# Altium project helix_4_multi_shield_host.PrjPcb
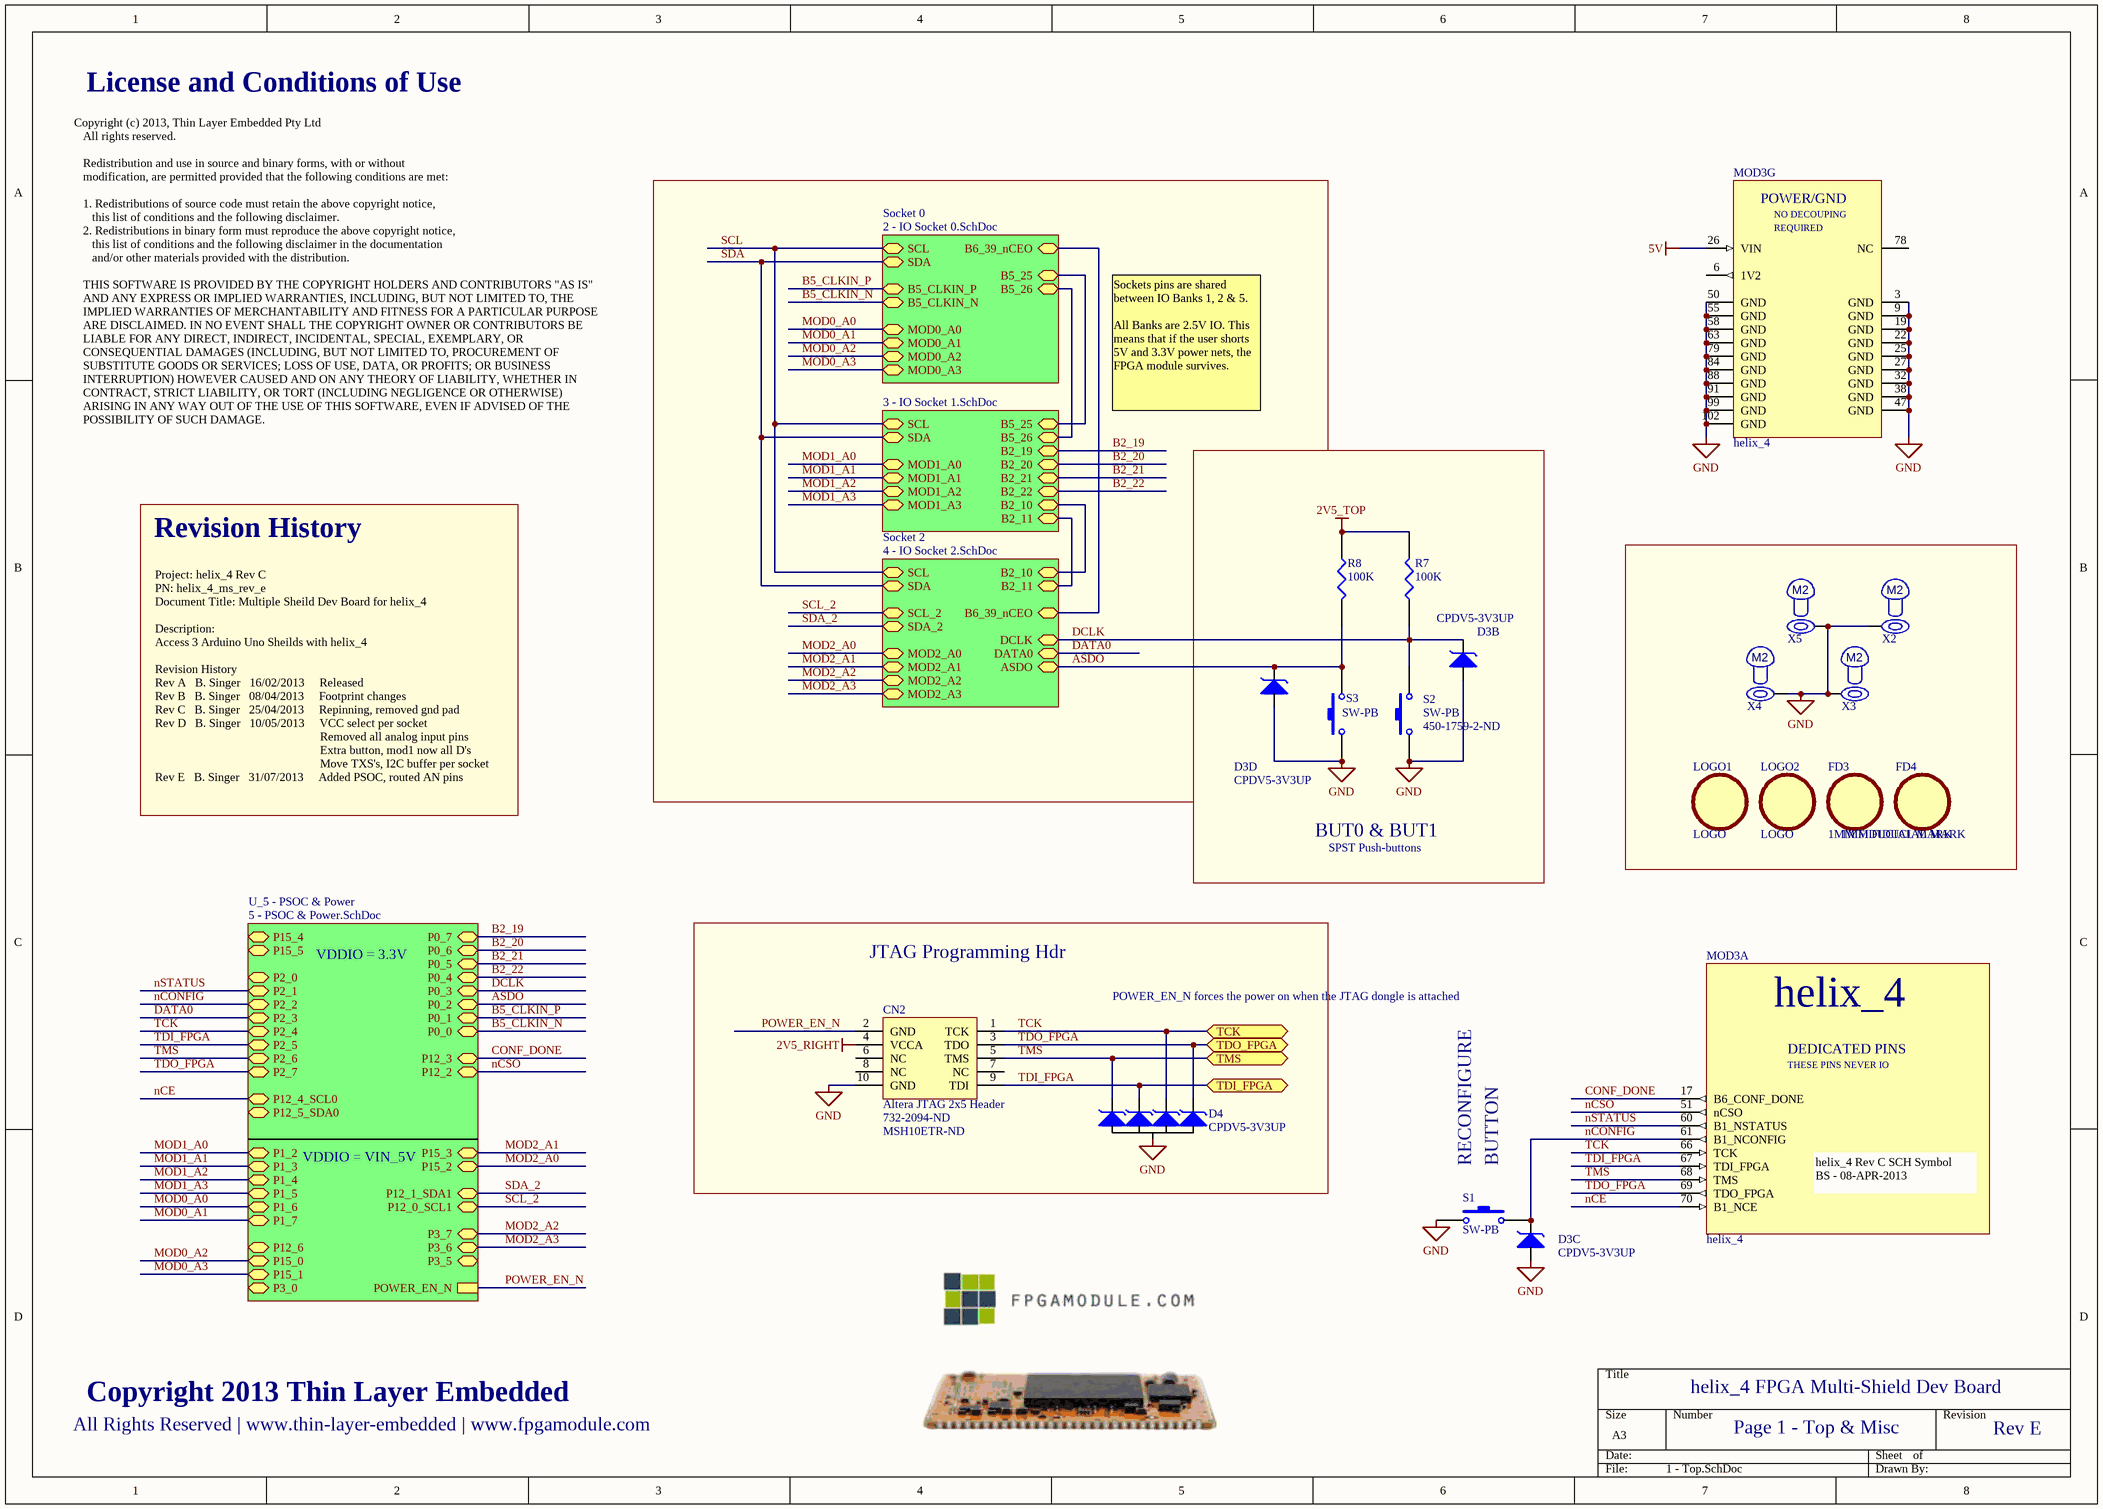
[diagram p0: 1 - Top.SchDoc]
5 sheets, 121 parts. Net scope: hierarchical (ports join the sheet entries above them; power ports are global).
Board file: helix_4_multi_shield_host.PcbDoc
Sheets:
  1 - Top.SchDoc
    Socket 1 = 3 - IO Socket 1.SchDoc
    Socket 0 = 2 - IO Socket 0.SchDoc
    Socket 2 = 4 - IO Socket 2.SchDoc
    U_5 - PSOC & Power = 5 - PSOC & Power.SchDoc

## Sheet 1 - Top.SchDoc
size A3; PageSetup: Record=PageOptions|CenterHorizontal=True|CenterVertical=True|PrintScale=0.71|XCorrection=1.00|YCorrection=1.00|PrintKind=0|BorderSize=5000000|LeftOffset=0|BottomOffset=0|Orientation=2|PaperLength=2970|PaperWidth=2100|Scale=100|PaperSource=7|PrintQuality=-4|MediaType=1|DitherType=10|PaperKind=A4 (210 x 297 mm)|PrintScaleMode=1

### Parts
CN2  Altera JTAG 2x5 Header  Supplier Part Number 1: 732-2094-ND  Supplier Part Number 2: MSH10ETR-ND  [BOXHDR2X5]
D3  CPDV5-3V3UP  [sot-353]  (parts B,C,D of 4)
D4  CPDV5-3V3UP  [SOT-353]
FD3  1MM FIDUCIAL MARK  [FID_1MM]
FD4  1MM FIDUCIAL MARK  [FID_1MM]
LOGO1  LOGO  [LOGO_LARGE]
LOGO2  LOGO  [LOGO_LARGE]
MOD3  helix_4  [HELIX_4_LCC104_HOST]  (parts A,G of 7)
R7  100K  [0805]
R8  100K  [0805]
S1  SW-PB  [FSM4JSMA]
S2  SW-PB  [FSM4JSMA]
S3  SW-PB  Supplier Part Number 1: 450-1759-2-ND  [FSM4JSMA]
X2  M2 Mounting Hole  [Mounting_Hole_M3]  (value not drawn)
X3  M2 Mounting Hole  [Mounting_Hole_M3]  (value not drawn)
X4  M2 Mounting Hole  [Mounting_Hole_M3]  (value not drawn)
X5  M2 Mounting Hole  [Mounting_Hole_M3]  (value not drawn)

### Blocks framed on the sheet
BUT0 & BUT1: D3 R7 R8 S2 S3
JTAG Programming Hdr: CN2 D4

### Sub-sheets
Socket 0 = 2 - IO Socket 0.SchDoc: SCL, SDA, B5_25, B5_26, B6_39_nCEO, B5_CLKIN_P, B5_CLKIN_N, MOD0_A0, MOD0_A1, MOD0_A2, MOD0_A3
Socket 1 = 3 - IO Socket 1.SchDoc: SDA, SCL, B5_26, B5_25, MOD1_A0, MOD1_A1, MOD1_A2, MOD1_A3, B2_10, B2_11, B2_19, B2_20, B2_21, B2_22
Socket 2 = 4 - IO Socket 2.SchDoc: SDA, SCL, DCLK, DATA0, B6_39_nCEO, ASDO, MOD2_A0, MOD2_A1, MOD2_A2, MOD2_A3, SDA_2, SCL_2, B2_10, B2_11
U_5 - PSOC & Power = 5 - PSOC & Power.SchDoc: P15_4, P15_5, P12_6, P2_0, P1_5, P1_6, P1_7, P2_1, P2_2, P2_3, P2_4, P2_5, P2_6, P2_7, P12_3, P12_2, POWER_EN_N, P0_0, P1_4, P1_3, P12_4_SCL0, P12_5_SDA0, P12_1_SDA1, P12_0_SCL1, P1_2, P0_1, P0_2, P0_3, P0_4, P0_5, P0_6, P0_7, P3_5, P3_6, P3_7, P15_0, P15_2, P15_3, P15_1, P3_0

### Ports
TCK, TDI_FPGA, TDO_FPGA, TMS

### Nets
2V5_RIGHT: CN2.4(VCCA)
2V5_TOP: R7.1 R8.1
5V: MOD3.26(VIN)
GND: CN2.10(GND) D3.2(A) D4.2(A) MOD3.3(GND) MOD3.9(GND) MOD3.19(GND) MOD3.22(GND) MOD3.25(GND) MOD3.27(GND) MOD3.32(GND) MOD3.38(GND) MOD3.47(GND) MOD3.50(GND) MOD3.55(GND) MOD3.58(GND) MOD3.63(GND) MOD3.79(GND) MOD3.84(GND) MOD3.88(GND) MOD3.91(GND) MOD3.99(GND) MOD3.102(GND) S1.1 S2.1 S3.1 X2.1 X3.1 X4.1 X5.1
ASDO: D3.4(K4) R8.2 S3.2 ; sheet Socket 2/ASDO, sheet U_5 - PSOC & Power/P0_2
B1_10: sheet Socket 1/B2_10, sheet Socket 2/B2_10
B1_11: sheet Socket 1/B2_11, sheet Socket 2/B2_11
B2_19: sheet Socket 1/B2_19, sheet U_5 - PSOC & Power/P0_7
B2_20: sheet Socket 1/B2_20, sheet U_5 - PSOC & Power/P0_6
B2_21: sheet Socket 1/B2_21, sheet U_5 - PSOC & Power/P0_5
B2_22: sheet Socket 1/B2_22, sheet U_5 - PSOC & Power/P0_4
B5_25: sheet Socket 1/B5_25, sheet Socket 0/B5_25
B5_26: sheet Socket 1/B5_26, sheet Socket 0/B5_26
B5_CLKIN_N: sheet Socket 0/B5_CLKIN_N, sheet U_5 - PSOC & Power/P0_0
B5_CLKIN_P: sheet Socket 0/B5_CLKIN_P, sheet U_5 - PSOC & Power/P0_1
B6_39_nCEO: sheet Socket 0/B6_39_nCEO, sheet Socket 2/B6_39_nCEO
CONF_DONE: MOD3.17(B6_CONF_DONE) ; sheet U_5 - PSOC & Power/P12_3
DATA0: sheet Socket 2/DATA0, sheet U_5 - PSOC & Power/P2_3
DCLK: D3.1(K2) R7.2 S2.2 ; sheet Socket 2/DCLK, sheet U_5 - PSOC & Power/P0_3
MOD0_A0: sheet Socket 0/MOD0_A0, sheet U_5 - PSOC & Power/P1_6
MOD0_A1: sheet Socket 0/MOD0_A1, sheet U_5 - PSOC & Power/P1_7
MOD0_A2: sheet Socket 0/MOD0_A2, sheet U_5 - PSOC & Power/P15_0
MOD0_A3: sheet Socket 0/MOD0_A3, sheet U_5 - PSOC & Power/P15_1
MOD1_A0: sheet Socket 1/MOD1_A0, sheet U_5 - PSOC & Power/P1_2
MOD1_A1: sheet Socket 1/MOD1_A1, sheet U_5 - PSOC & Power/P1_3
MOD1_A2: sheet Socket 1/MOD1_A2, sheet U_5 - PSOC & Power/P1_4
MOD1_A3: sheet Socket 1/MOD1_A3, sheet U_5 - PSOC & Power/P1_5
MOD2_A0: sheet Socket 2/MOD2_A0, sheet U_5 - PSOC & Power/P15_2
MOD2_A1: sheet Socket 2/MOD2_A1, sheet U_5 - PSOC & Power/P15_3
MOD2_A2: sheet Socket 2/MOD2_A2, sheet U_5 - PSOC & Power/P3_7
MOD2_A3: sheet Socket 2/MOD2_A3, sheet U_5 - PSOC & Power/P3_6
nCE: MOD3.70(B1_NCE) ; sheet U_5 - PSOC & Power/P12_4_SCL0
nCONFIG: D3.5(K3) MOD3.61(B1_NCONFIG) S1.2 ; sheet U_5 - PSOC & Power/P2_2
nCSO: MOD3.51(nCSO) ; sheet U_5 - PSOC & Power/P12_2
nSTATUS: MOD3.60(B1_NSTATUS) ; sheet U_5 - PSOC & Power/P2_1
POWER_EN_N: CN2.2(GND) ; sheet U_5 - PSOC & Power/POWER_EN_N
SCL: sheet Socket 1/SCL, sheet Socket 0/SCL, sheet Socket 2/SCL
SCL_2: sheet Socket 2/SCL_2, sheet U_5 - PSOC & Power/P12_0_SCL1
SDA: sheet Socket 1/SDA, sheet Socket 0/SDA, sheet Socket 2/SDA
SDA_2: sheet Socket 2/SDA_2, sheet U_5 - PSOC & Power/P12_1_SDA1
TCK: CN2.1(TCK) D4.5(K1) MOD3.66(TCK) ; port TCK, sheet U_5 - PSOC & Power/P2_4
TDI_FPGA: CN2.9(TDI) D4.1(K2) MOD3.67(TDI_FPGA) ; port TDI_FPGA, sheet U_5 - PSOC & Power/P2_5
TDO_FPGA: CN2.3(TDO) D4.4(K2) MOD3.69(TDO_FPGA) ; port TDO_FPGA, sheet U_5 - PSOC & Power/P2_7
TMS: CN2.5(TMS) D4.3(K1) MOD3.68(TMS) ; port TMS, sheet U_5 - PSOC & Power/P2_6

Not connected (* = marked no-connect by the designer): CN2 6(NC) 7(NC) 8(NC); FD3 1(FID); FD4 1(FID); LOGO1 1(FID); LOGO2 1(FID); MOD3 6(1V2) 78(NC)

### Notes on the sheet
- License and Conditions of Use
- Sockets pins are shared between IO Banks 1, 2 & 5.
  All Banks are 2.5V IO. This means that if the user shorts 5V and 3.3V power nets, the FPGA module survives.
- Copyright (c) 2013, Thin Layer Embedded Pty Ltd
  All rights reserved.
  Redistribution and use in source and binary forms, with or without
  modification, are permitted provided that the following conditions are met:
  1. Redistributions of source code must retain the above copyright notice,
  this list of conditions and the following disclaimer.
  2. Redistributions in binary form must reproduce the above copyright notice,
  this list of conditions and the following disclaimer in the documentation
  and/or other materials provided with the distribution.
  THIS SOFTWARE IS PROVIDED BY THE COPYRIGHT HOLDERS AND CONTRIBUTORS "AS IS"
  AND ANY EXPRESS OR IMPLIED WARRANTIES, INCLUDING, BUT NOT LIMITED TO, THE
  IMPLIED WARRANTIES OF MERCHANTABILITY AND FITNESS FOR A PARTICULAR PURPOSE
  ARE DISCLAIMED. IN NO EVENT SHALL THE COPYRIGHT OWNER OR CONTRIBUTORS BE
  LIABLE FOR ANY DIRECT, INDIRECT, INCIDENTAL, SPECIAL, EXEMPLARY, OR
  CONSEQUENTIAL DAMAGES (INCLUDING, BUT NOT LIMITED TO, PROCUREMENT OF
  SUBSTITUTE GOODS OR SERVICES; LOSS OF USE, DATA, OR PROFITS; OR BUSINESS
  INTERRUPTION) HOWEVER CAUSED AND ON ANY THEORY OF LIABILITY, WHETHER IN
  CONTRACT, STRICT LIABILITY, OR TORT (INCLUDING NEGLIGENCE OR OTHERWISE)
  ARISING IN ANY WAY OUT OF THE USE OF THIS SOFTWARE, EVEN IF ADVISED OF THE
  POSSIBILITY OF SUCH DAMAGE.
- Revision History
- Project: helix_4 Rev C
  PN: helix_4_ms_rev_e
  Document Title: Multiple Sheild Dev Board for helix_4
  Description:
  Access 3 Arduino Uno Sheilds with helix_4
  Revision History
  Rev A   B. Singer   16/02/2013     Released
  Rev B   B. Singer   08/04/2013     Footprint changes
  Rev C   B. Singer   25/04/2013     Repinning, removed gnd pad
  Rev D   B. Singer   10/05/2013     VCC select per socket
  Removed all analog input pins
  Extra button, mod1 now all D's
  Move TXS's, I2C buffer per socket
  Rev E   B. Singer   31/07/2013     Added PSOC, routed AN pins
- SPST Push-buttons
- VDDIO = 3.3V
- (near CN2) POWER_EN_N forces the power on when the JTAG dongle is attached
- VDDIO = VIN_5V
- RECONFIGURE
- BUTTON
- helix_4 FPGA Multi-Shield Dev Board
- All Rights Reserved | www.thin-layer-embedded | www.fpgamodule.com
- Copyright 2013 Thin Layer Embedded
- Page 1 - Top & Misc
- Rev E
- (in symbol helix_4 Rev C Module, part A) DEDICATED PINS; THESE PINS NEVER IO; helix_4 Rev C SCH Symbol / BS - 08-APR-2013 /
- (in symbol helix_4 Rev C Module, part G) POWER/GND; NO DECOUPING; REQUIRED
- (in symbol Mounting_Hole_M2) M2

### Library data of the parts
CN2 = Altera JTAG 2x5 Header: Header, 5-Pin, Dual row; Manufacturer: Wurth Electronics Inc; Manufacturer Part Number: 61201021621; Description: BOX HEADER 2.54MM MALE STR 10POS; Connector Type: Header, Shrouded; Number of Positions: 10; Number of Positions Loaded: All; Pitch: 0.100" (2.54mm); LatestRevisionDate: 17-Jul-2002; LatestRevisionNote: Re-released for DXP Platform.; Publisher: Altium Limited; Supplier 1: Digi-Key; RoHS: RoHS Compliant; Category: Connectors, Interconnects; Stock 1: 324; Pricing 1: 1=0.97, 25=0.8052, 100=0.713, 250=0.63252, 500=0.575, 1000=0.46, 2500=0.4025, 5000=0.3335, 10000=0.3059 (USD); Contact Type: Male Pin; Number of Rows: 2; Row Spacing: 0.100" (2.54mm); Contact Mating Length: -; Mounting Type: Through Hole; Termination: Solder; Fastening Type: -; Features: -; Contact Finish: Gold; Contact Finish Thickness: -; Color: Black; Packaging: Tray; ComponentLink1URL: http://www.we-online.de/eican/media/pdf/6120xx21621.pdf; ComponentLink1Description: http://www.we-online.de/eican/media/pdf/6120xx21621.pdf; Supplier 2: Digi-Key
D3 = 4CH ESD DIODE (SPLIT): 4CH ESD DIODE 3V3/3.5V
D4 = 4CH ESD DIODE: 4CH ESD DIODE 3V3/3.5V
FD3 FD4 LOGO1 LOGO2 = FID
MOD3 = helix_4 Rev C Module
R7 R8 = RES1
S1-S3 = SW-PB: Switch; Published: 24-Mar-1999; LatestRevisionDate: 17-Jul-2002; LatestRevisionNote: Re-released for DXP Platform.; PackageReference: SPST-2; Publisher: Altium Limited
  S3: Supplier 1: Digi-Key
X2-X5 = Mounting_Hole_M2: Hole for M3 Screw

## Sheet 3 - IO Socket 1.SchDoc
size A4
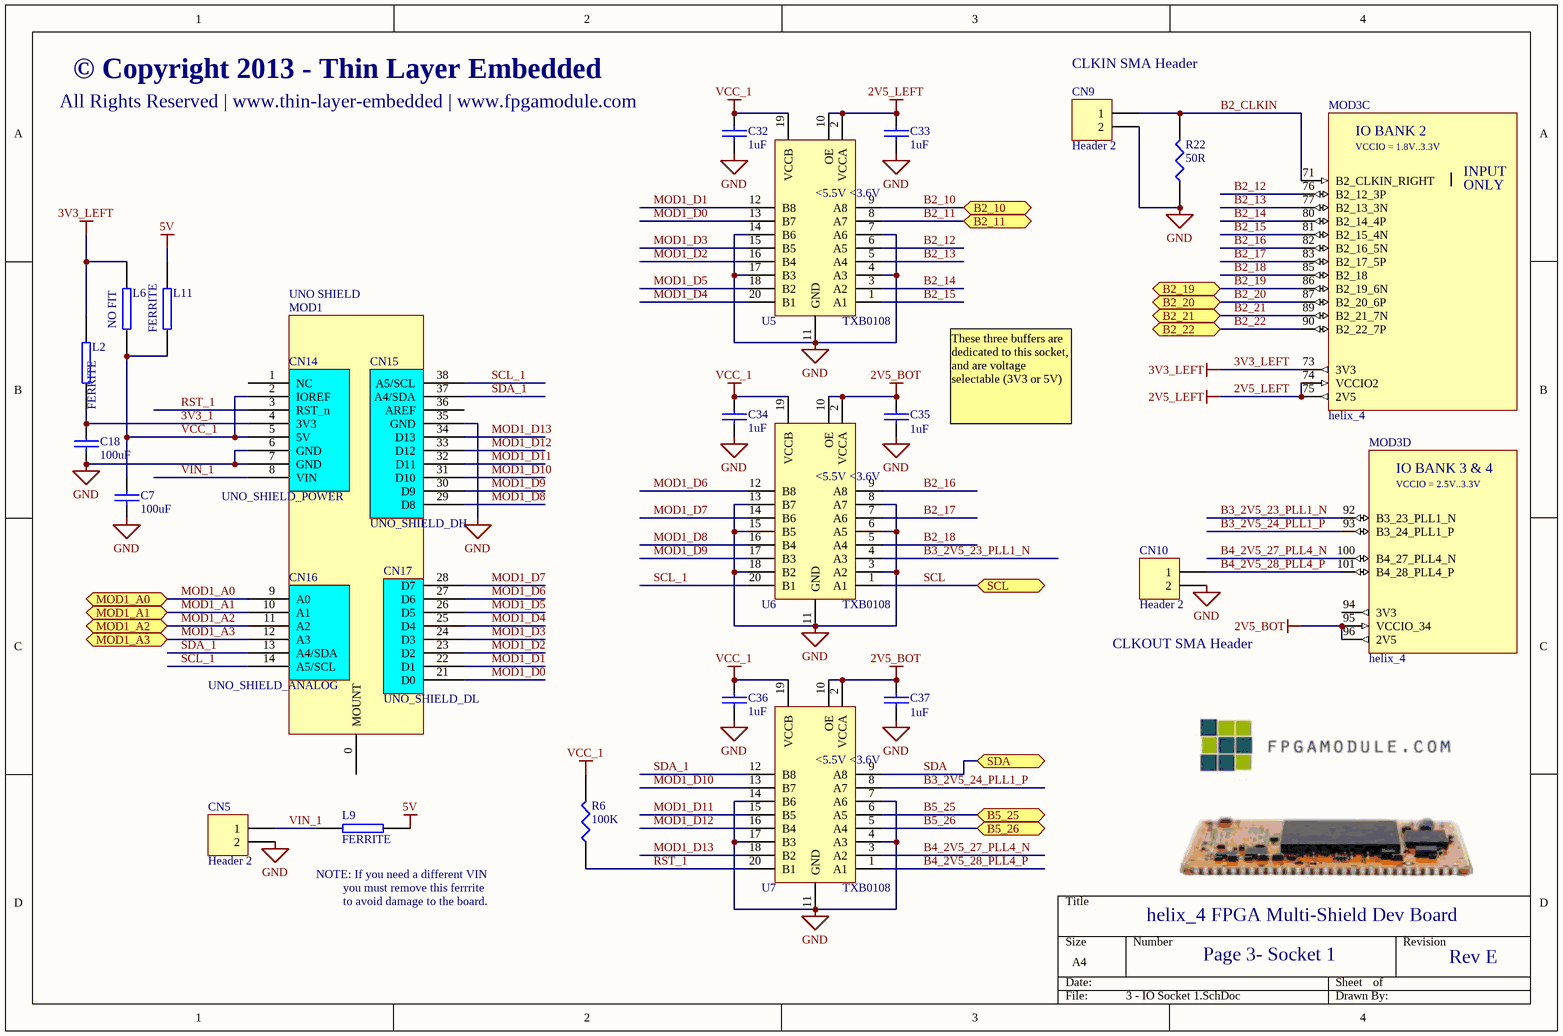
[diagram p1: 3 - IO Socket 1.SchDoc]

### Parts
C7  100uF  [1210]
C18  100uF  [1210]
C32  1uF  [0805]
C33  1uF  [0805]
C34  1uF  [0805]
C35  1uF  [0805]
C36  1uF  [0805]
C37  1uF  [0805]
CN5  Header 2  [HDR1X2]
CN9  Header 2  [SMA_V]
CN10  Header 2  [SMA_V]
CN14  UNO_SHIELD_POWER  [UNO_SHIELD_POWER]
CN15  UNO_SHIELD_DH  [UNO_SHIELD_DH]
CN16  UNO_SHIELD_ANALOG  [UNO_SHIELD_ANALOG]
CN17  UNO_SHIELD_DL  [UNO_SHIELD_DL]
L2  FERRITE  [0805]
L6  NO FIT  [0805]
L9  FERRITE  [0805]
L11  FERRITE  [0805]
MOD1  UNO SHIELD  [UNO_SHIELD_MECH]
MOD3  helix_4  [HELIX_4_LCC104_HOST]  (parts C,D of 7)
R6  100K  [0805]
R22  50R  [0805]
U5  TXB0108  [TSSOP20]
U6  TXB0108  [TSSOP20]
U7  TXB0108  [TSSOP20]

### Ports
B2_10, B2_11, B2_19, B2_20, B2_21, B2_22, B5_25, B5_26, MOD1_A0, MOD1_A1, MOD1_A2, MOD1_A3, SCL, SDA

### Nets
2V5_BOT: C35.2 C37.2 MOD3.95(VCCIO_34) MOD3.96(2V5) U6.2(VCCA) U6.10(OE) U7.2(VCCA) U7.10(OE)
2V5_LEFT: C33.2 MOD3.74(VCCIO2) MOD3.75(2V5) U5.2(VCCA) U5.10(OE)
3V3_LEFT: L2.1 L6.1 MOD3.73(3V3)
5V: L9.1 L11.1
GND: C7.2 C18.2 C32.1 C33.1 C34.1 C35.1 C36.1 C37.1 CN5.2 CN9.2 CN10.2 CN14.6(GND) CN14.7(GND) CN15.35(GND) R22.1 U5.4(A3) U5.7(A6) U5.11(GND) U5.14(B6) U5.17(B3) U6.3(A2) U6.6(A5) U6.8(A7) U6.11(GND) U6.13(B7) U6.15(B5) U6.18(B2) U7.4(A3) U7.7(A6) U7.11(GND) U7.14(B6) U7.17(B3)
VCC_1: C7.1 C32.2 C34.2 C36.2 CN14.2(IOREF) CN14.5(5V) L6.2 L11.2 R6.2 U5.19(VCCB) U6.19(VCCB) U7.19(VCCB)
3V3_1: C18.1 CN14.4(3V3) L2.2
B2_10: U5.9(A8) ; port B2_10  [project net B1_10]
B2_11: U5.8(A7) ; port B2_11  [project net B1_11]
B2_12: MOD3.76(B2_12_3P) U5.6(A5)
B2_13: MOD3.77(B2_13_3N) U5.5(A4)
B2_14: MOD3.80(B2_14_4P) U5.3(A2)
B2_15: MOD3.81(B2_15_4N) U5.1(A1)
B2_16: MOD3.82(B2_16_5N) U6.9(A8)
B2_17: MOD3.83(B2_17_5P) U6.7(A6)
B2_18: MOD3.85(B2_18) U6.5(A4)
B2_19: MOD3.86(B2_19_6N) ; port B2_19
B2_20: MOD3.87(B2_20_6P) ; port B2_20
B2_21: MOD3.89(B2_21_7N) ; port B2_21
B2_22: MOD3.90(B2_22_7P) ; port B2_22
B2_CLKIN: CN9.1 MOD3.71(B2_CLKIN_RIGHT) R22.2
B3_2V5_23_PLL1_N: MOD3.92(B3_23_PLL1_N) U6.4(A3)
B3_2V5_24_PLL1_P: MOD3.93(B3_24_PLL1_P) U7.8(A7)
B4_2V5_27_PLL4_N: MOD3.100(B4_27_PLL4_N) U7.3(A2)
B4_2V5_28_PLL4_P: CN10.1 MOD3.101(B4_28_PLL4_P) U7.1(A1)
B5_25: U7.6(A5) ; port B5_25
B5_26: U7.5(A4) ; port B5_26
MOD1_A0: CN16.9(A0) ; port MOD1_A0
MOD1_A1: CN16.10(A1) ; port MOD1_A1
MOD1_A2: CN16.11(A2) ; port MOD1_A2
MOD1_A3: CN16.12(A3) ; port MOD1_A3
MOD1_D0: CN17.21(D0) U5.13(B7)
MOD1_D1: CN17.22(D1) U5.12(B8)
MOD1_D2: CN17.23(D2) U5.16(B4)
MOD1_D3: CN17.24(D3) U5.15(B5)
MOD1_D4: CN17.25(D4) U5.20(B1)
MOD1_D5: CN17.26(D5) U5.18(B2)
MOD1_D6: CN17.27(D6) U6.12(B8)
MOD1_D7: CN17.28(D7) U6.14(B6)
MOD1_D8: CN15.29(D8) U6.16(B4)
MOD1_D9: CN15.30(D9) U6.17(B3)
MOD1_D10: CN15.31(D10) U7.13(B7)
MOD1_D11: CN15.32(D11) U7.15(B5)
MOD1_D12: CN15.33(D12) U7.16(B4)
MOD1_D13: CN15.34(D13) U7.18(B2)
RST_1: CN14.3(RST_n) R6.1 U7.20(B1)
SCL: U6.1(A1) ; port SCL
SCL_1: CN15.38(A5/SCL) CN16.14(A5/SCL) U6.20(B1)
SDA: U7.9(A8) ; port SDA
SDA_1: CN15.37(A4/SDA) CN16.13(A4/SDA) U7.12(B8)
VIN_1: CN5.1 CN14.8(VIN) L9.2

Not connected (* = marked no-connect by the designer): CN14 1(NC); CN15 36(AREF); MOD1 0(MOUNT); MOD3 94(3V3)

### Notes on the sheet
- (near C32) All Rights Reserved | www.thin-layer-embedded | www.fpgamodule.com
- © Copyright 2013 - Thin Layer Embedded
- (near CN9) CLKIN SMA Header
- These three buffers are dedicated to this socket, and are voltage selectable (3V3 or 5V)
- (near CN10) CLKOUT SMA Header
- (near L9) NOTE: If you need a different VIN
- you must remove this ferrrite
- to avoid damage to the board.
- helix_4 FPGA Multi-Shield Dev Board
- Page 3- Socket 1
- Rev E
- (in symbol helix_4 Rev C Module, part C) IO BANK 2; VCCIO = 1.8V..3.3V; INPUT; ONLY
- (in symbol helix_4 Rev C Module, part D) IO BANK 3 & 4; VCCIO = 2.5V..3.3V
- (in symbol TXB0108) <5.5V; <3.6V

### Library data of the parts
C7 C18 C32-C37 = CAP: Capacitor
CN5 CN9 CN10 = Header 2: Header, 2-Pin; LatestRevisionDate: 17-Jul-2002; LatestRevisionNote: Re-released for DXP Platform.; Publisher: Altium Limited
L6 = FERRITE
MOD1 = UNO_SHIELD_MECH
MOD3 = helix_4 Rev C Module
R6 R22 = RES1
U5-U7 = TXB0108: TI Bir-dir buffer

## Sheet 2 - IO Socket 0.SchDoc
size A4
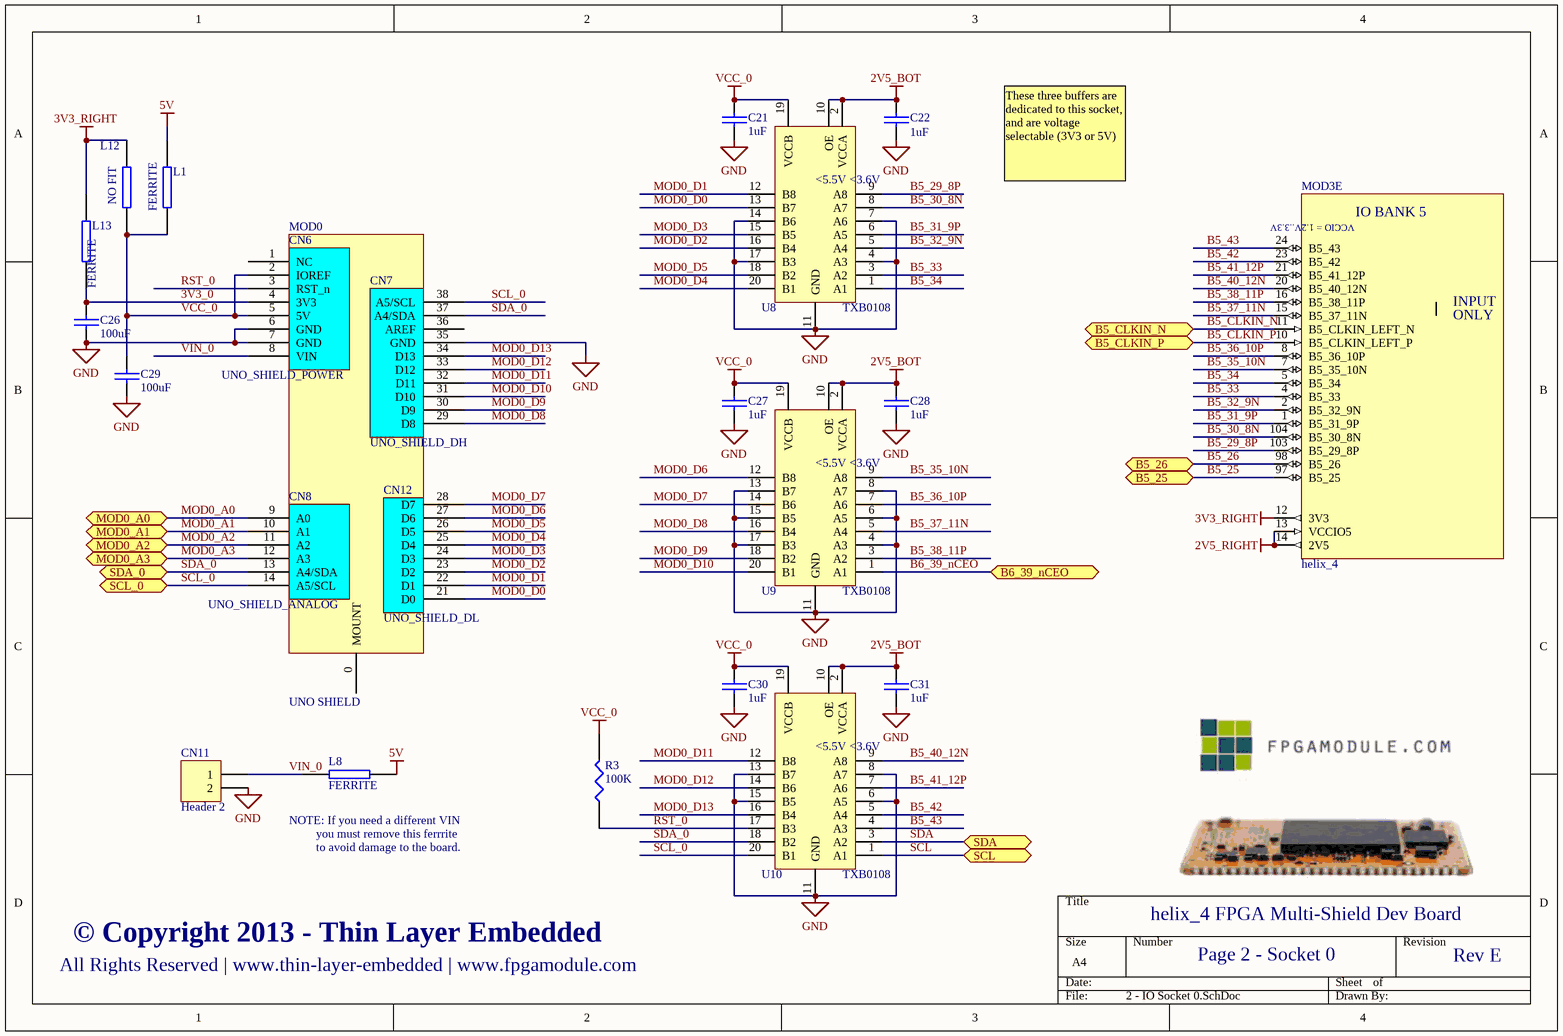
[diagram p2: 2 - IO Socket 0.SchDoc]

### Parts
C21  1uF  [0805]
C22  1uF  [0805]
C26  100uF  [1210]
C27  1uF  [0805]
C28  1uF  [0805]
C29  100uF  [1210]
C30  1uF  [0805]
C31  1uF  [0805]
CN6  UNO_SHIELD_POWER  [UNO_SHIELD_POWER]
CN7  UNO_SHIELD_DH  [UNO_SHIELD_DH]
CN8  UNO_SHIELD_ANALOG  [UNO_SHIELD_ANALOG]
CN11  Header 2  [HDR1X2]
CN12  UNO_SHIELD_DL  [UNO_SHIELD_DL]
L1  FERRITE  [0805]
L8  FERRITE  [0805]
L12  NO FIT  [0805]
L13  FERRITE  [0805]
MOD0  UNO SHIELD  [UNO_SHIELD_MECH]
MOD3  helix_4  [HELIX_4_LCC104_HOST]  (part E of 7)
R3  100K  [0805]
U8  TXB0108  [TSSOP20]
U9  TXB0108  [TSSOP20]
U10  TXB0108  [TSSOP20]

### Ports
B5_25, B5_26, B5_CLKIN_N, B5_CLKIN_P, B6_39_nCEO, MOD0_A0, MOD0_A1, MOD0_A2, MOD0_A3, SCL, SCL_0, SDA, SDA_0

### Nets
2V5_BOT: C22.2 C28.2 C31.2 U8.2(VCCA) U8.10(OE) U9.2(VCCA) U9.10(OE) U10.2(VCCA) U10.10(OE)
2V5_RIGHT: MOD3.13(VCCIO5) MOD3.14(2V5)
3V3_RIGHT: L12.1 L13.1 MOD3.12(3V3)
5V: L1.1 L8.1
GND: C21.1 C22.1 C26.2 C27.1 C28.1 C29.2 C30.1 C31.1 CN6.6(GND) CN6.7(GND) CN7.35(GND) CN11.2 U8.4(A3) U8.7(A6) U8.11(GND) U8.14(B6) U8.17(B3) U9.4(A3) U9.6(A5) U9.8(A7) U9.11(GND) U9.13(B7) U9.15(B5) U9.17(B3) U10.6(A5) U10.8(A7) U10.11(GND) U10.13(B7) U10.15(B5)
VCC_0: C21.2 C27.2 C29.1 C30.2 CN6.2(IOREF) CN6.5(5V) L1.2 L12.2 R3.2 U8.19(VCCB) U9.19(VCCB) U10.19(VCCB)
3V3_0: C26.1 CN6.4(3V3) L13.2
B5_25: MOD3.97(B5_25) ; port B5_25
B5_26: MOD3.98(B5_26) ; port B5_26
B5_29_8P: MOD3.103(B5_29_8P) U8.9(A8)
B5_30_8N: MOD3.104(B5_30_8N) U8.8(A7)
B5_31_9P: MOD3.1(B5_31_9P) U8.6(A5)
B5_32_9N: MOD3.2(B5_32_9N) U8.5(A4)
B5_33: MOD3.4(B5_33) U8.3(A2)
B5_34: MOD3.5(B5_34) U8.1(A1)
B5_35_10N: MOD3.7(B5_35_10N) U9.9(A8)
B5_36_10P: MOD3.8(B5_36_10P) U9.7(A6)
B5_37_11N: MOD3.15(B5_37_11N) U9.5(A4)
B5_38_11P: MOD3.16(B5_38_11P) U9.3(A2)
B5_40_12N: MOD3.20(B5_40_12N) U10.9(A8)
B5_41_12P: MOD3.21(B5_41_12P) U10.7(A6)
B5_42: MOD3.23(B5_42) U10.5(A4)
B5_43: MOD3.24(B5_43) U10.4(A3)
B5_CLKIN_N: MOD3.11(B5_CLKIN_LEFT_N) ; port B5_CLKIN_N
B5_CLKIN_P: MOD3.10(B5_CLKIN_LEFT_P) ; port B5_CLKIN_P
B6_39_nCEO: U9.1(A1) ; port B6_39_nCEO
MOD0_A0: CN8.9(A0) ; port MOD0_A0
MOD0_A1: CN8.10(A1) ; port MOD0_A1
MOD0_A2: CN8.11(A2) ; port MOD0_A2
MOD0_A3: CN8.12(A3) ; port MOD0_A3
MOD0_D0: CN12.21(D0) U8.13(B7)
MOD0_D1: CN12.22(D1) U8.12(B8)
MOD0_D2: CN12.23(D2) U8.16(B4)
MOD0_D3: CN12.24(D3) U8.15(B5)
MOD0_D4: CN12.25(D4) U8.20(B1)
MOD0_D5: CN12.26(D5) U8.18(B2)
MOD0_D6: CN12.27(D6) U9.12(B8)
MOD0_D7: CN12.28(D7) U9.14(B6)
MOD0_D8: CN7.29(D8) U9.16(B4)
MOD0_D9: CN7.30(D9) U9.18(B2)
MOD0_D10: CN7.31(D10) U9.20(B1)
MOD0_D11: CN7.32(D11) U10.12(B8)
MOD0_D12: CN7.33(D12) U10.14(B6)
MOD0_D13: CN7.34(D13) U10.16(B4)
RST_0: CN6.3(RST_n) R3.1 U10.17(B3)
SCL: U10.1(A1) ; port SCL
SCL_0: CN7.38(A5/SCL) CN8.14(A5/SCL) U10.20(B1) ; port SCL_0
SDA: U10.3(A2) ; port SDA
SDA_0: CN7.37(A4/SDA) CN8.13(A4/SDA) U10.18(B2) ; port SDA_0
VIN_0: CN6.8(VIN) CN11.1 L8.2

Not connected (* = marked no-connect by the designer): CN6 1(NC); CN7 36(AREF); MOD0 0(MOUNT)

### Notes on the sheet
- These three buffers are dedicated to this socket, and are voltage selectable (3V3 or 5V)
- (near L8) NOTE: If you need a different VIN
- you must remove this ferrrite
- to avoid damage to the board.
- helix_4 FPGA Multi-Shield Dev Board
- All Rights Reserved | www.thin-layer-embedded | www.fpgamodule.com
- © Copyright 2013 - Thin Layer Embedded
- Page 2 - Socket 0
- Rev E
- (in symbol helix_4 Rev C Module, part E) IO BANK 5; VCCIO = 1.2V..3.3V; INPUT; ONLY
- (in symbol TXB0108) <5.5V; <3.6V

### Library data of the parts
C21 C22 C26-C31 = CAP: Capacitor
CN11 = Header 2: Header, 2-Pin; LatestRevisionDate: 17-Jul-2002; LatestRevisionNote: Re-released for DXP Platform.; Publisher: Altium Limited
L12 = FERRITE
MOD0 = UNO_SHIELD_MECH
MOD3 = helix_4 Rev C Module
R3 = RES1
U8-U10 = TXB0108: TI Bir-dir buffer

## Sheet 4 - IO Socket 2.SchDoc
size A4
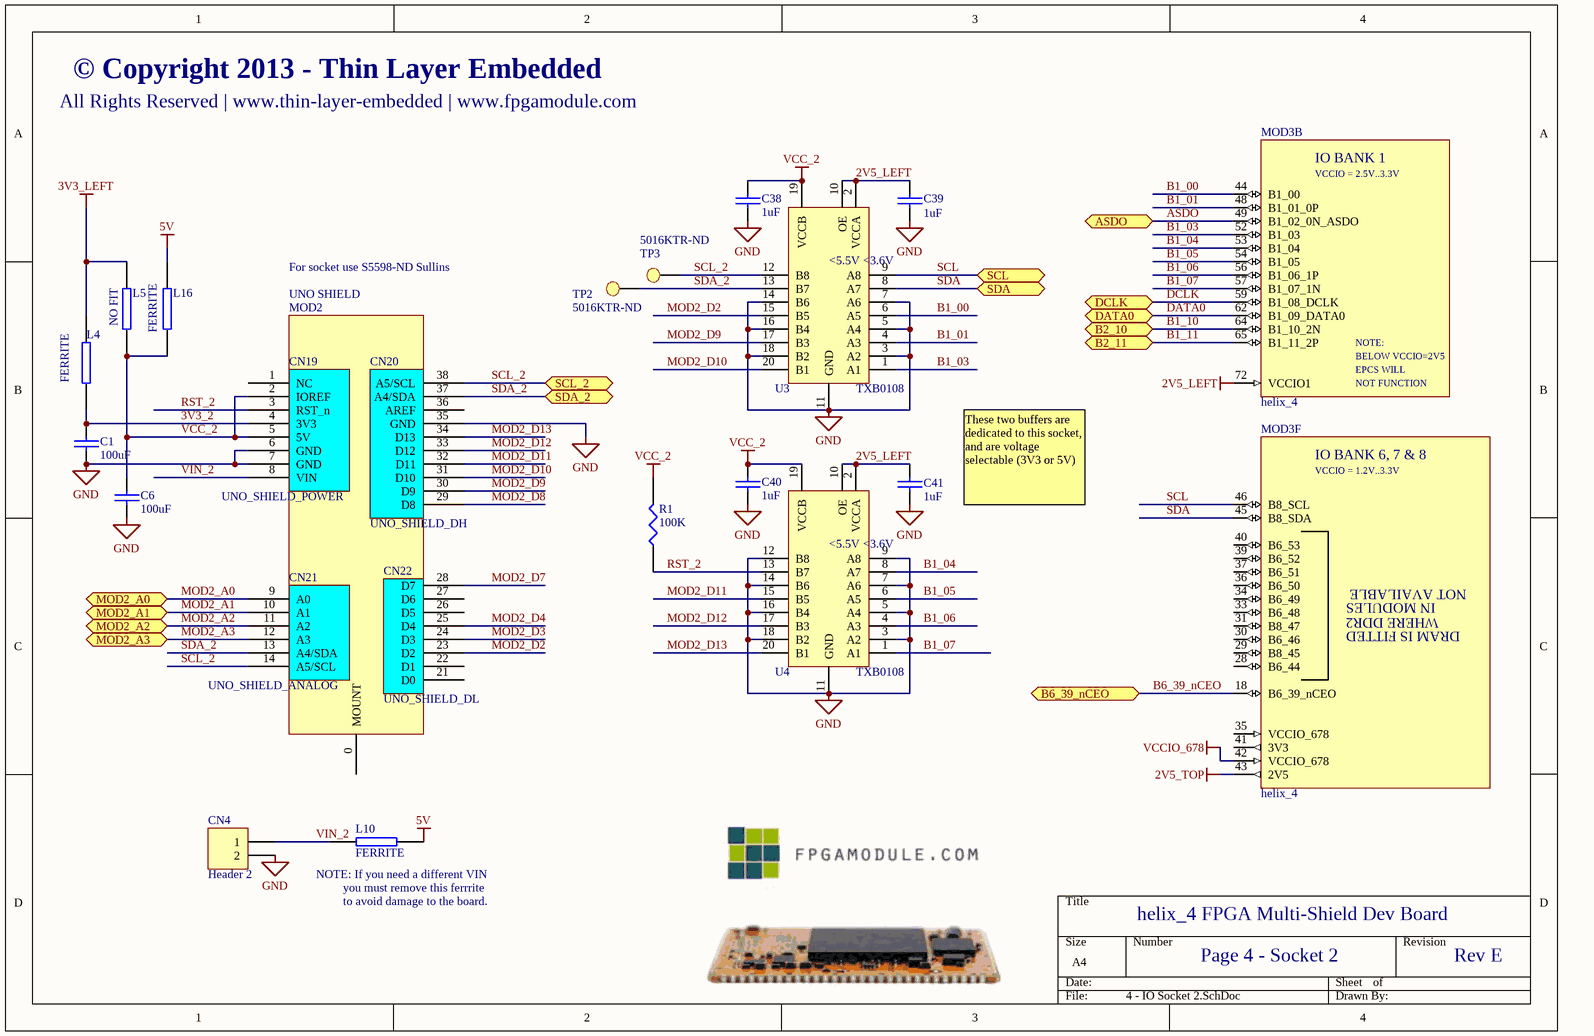
[diagram p3: 4 - IO Socket 2.SchDoc]

### Parts
C1  100uF  [1210]
C6  100uF  [1210]
C38  1uF  [0805]
C39  1uF  [0805]
C40  1uF  [0805]
C41  1uF  [0805]
CN4  Header 2  [HDR1X2]
CN19  UNO_SHIELD_POWER  [UNO_SHIELD_POWER]
CN20  UNO_SHIELD_DH  [UNO_SHIELD_DH]
CN21  UNO_SHIELD_ANALOG  [UNO_SHIELD_ANALOG]
CN22  UNO_SHIELD_DL  [UNO_SHIELD_DL]
L4  FERRITE  [0805]
L5  NO FIT  [0805]
L10  FERRITE  [0805]
L16  FERRITE  [0805]
MOD2  UNO SHIELD  [UNO_SHIELD_MECH]
MOD3  helix_4  [HELIX_4_LCC104_HOST]  (parts B,F of 7)
R1  100K  [0805]
TP2  Supplier Part Number 2: 5016KTR-ND  [TEST_POINT]  (hidden comment: Test Point)
TP3  Supplier Part Number 2: 5016KTR-ND  [TEST_POINT]  (hidden comment: Test Point)
U3  TXB0108  [TSSOP20]
U4  TXB0108  [TSSOP20]

### Ports
ASDO, B2_10, B2_11, B6_39_nCEO, DATA0, DCLK, MOD2_A0, MOD2_A1, MOD2_A2, MOD2_A3, SCL, SCL_2, SDA, SDA_2

### Nets
2V5_LEFT: C39.2 C41.2 MOD3.72(VCCIO1) U3.2(VCCA) U3.10(OE) U4.2(VCCA) U4.10(OE)
2V5_TOP: MOD3.43(2V5)
3V3_LEFT: L4.1 L5.1
5V: L10.1 L16.1
GND: C1.2 C6.2 C38.1 C39.1 C40.1 C41.1 CN4.2 CN19.6(GND) CN19.7(GND) CN20.35(GND) U3.3(A2) U3.5(A4) U3.7(A6) U3.11(GND) U3.14(B6) U3.16(B4) U3.18(B2) U4.3(A2) U4.5(A4) U4.7(A6) U4.9(A8) U4.11(GND) U4.12(B8) U4.14(B6) U4.16(B4) U4.18(B2)
VCC_2: C6.1 C38.2 C40.2 CN19.2(IOREF) CN19.5(5V) L5.2 L16.2 R1.2 U3.19(VCCB) U4.19(VCCB)
VCCIO_678: MOD3.42(VCCIO_678)
3V3_2: C1.1 CN19.4(3V3) L4.2
ASDO: MOD3.49(B1_02_0N_ASDO) ; port ASDO
B1_00: MOD3.44(B1_00) U3.6(A5)
B1_01: MOD3.48(B1_01_0P) U3.4(A3)
B1_03: MOD3.52(B1_03) U3.1(A1)
B1_04: MOD3.53(B1_04) U4.8(A7)
B1_05: MOD3.54(B1_05) U4.6(A5)
B1_06: MOD3.56(B1_06_1P) U4.4(A3)
B1_07: MOD3.57(B1_07_1N) U4.1(A1)
B1_10: MOD3.64(B1_10_2N) ; port B2_10
B1_11: MOD3.65(B1_11_2P) ; port B2_11
B6_39_nCEO: MOD3.18(B6_39_nCEO) ; port B6_39_nCEO
DATA0: MOD3.62(B1_09_DATA0) ; port DATA0
DCLK: MOD3.59(B1_08_DCLK) ; port DCLK
MOD2_A0: CN21.9(A0) ; port MOD2_A0
MOD2_A1: CN21.10(A1) ; port MOD2_A1
MOD2_A2: CN21.11(A2) ; port MOD2_A2
MOD2_A3: CN21.12(A3) ; port MOD2_A3
MOD2_D2: CN22.23(D2) U3.15(B5)
MOD2_D3: CN22.24(D3)
MOD2_D4: CN22.25(D4)
MOD2_D7: CN22.28(D7)
MOD2_D8: CN20.29(D8)
MOD2_D9: CN20.30(D9) U3.17(B3)
MOD2_D10: CN20.31(D10) U3.20(B1)
MOD2_D11: CN20.32(D11) U4.15(B5)
MOD2_D12: CN20.33(D12) U4.17(B3)
MOD2_D13: CN20.34(D13) U4.20(B1)
RST_2: CN19.3(RST_n) R1.1 U4.13(B7)
SCL: MOD3.46(B8_SCL) U3.9(A8) ; port SCL
SCL_2: CN20.38(A5/SCL) CN21.14(A5/SCL) TP3.1 U3.12(B8) ; port SCL_2
SDA: MOD3.45(B8_SDA) U3.8(A7) ; port SDA
SDA_2: CN20.37(A4/SDA) CN21.13(A4/SDA) TP2.1 U3.13(B7) ; port SDA_2
VIN_2: CN4.1 CN19.8(VIN) L10.2

Not connected (* = marked no-connect by the designer): CN19 1(NC); CN20 36(AREF); CN22 21(D0) 22(D1) 26(D5) 27(D6); MOD2 0(MOUNT); MOD3 28(B6_44) 29(B8_45) 30(B6_46) 31(B8_47) 33(B6_48) 34(B6_49) 35(VCCIO_678) 36(B6_50) 37(B6_51) 39(B6_52) 40(B6_53) 41(3V3)

### Notes on the sheet
- All Rights Reserved | www.thin-layer-embedded | www.fpgamodule.com
- © Copyright 2013 - Thin Layer Embedded
- For socket use S5598-ND Sullins
- These two buffers are dedicated to this socket, and are voltage selectable (3V3 or 5V)
- (near L10) NOTE: If you need a different VIN
- (near L10) you must remove this ferrrite
- to avoid damage to the board.
- helix_4 FPGA Multi-Shield Dev Board
- Page 4 - Socket 2
- Rev E
- (in symbol helix_4 Rev C Module, part B) IO BANK 1; VCCIO = 2.5V..3.3V; NOTE:; BELOW VCCIO=2V5; EPCS WILL; NOT FUNCTION
- (in symbol helix_4 Rev C Module, part F) IO BANK 6, 7 & 8; VCCIO = 1.2V..3.3V; NOT AVAILABLE; IN MODULES; WHERE DDR2; DRAM IS FITTED
- (in symbol TXB0108) <5.5V; <3.6V

### Library data of the parts
C1 C6 C38-C41 = CAP: Capacitor
CN4 = Header 2: Header, 2-Pin; LatestRevisionDate: 17-Jul-2002; LatestRevisionNote: Re-released for DXP Platform.; Publisher: Altium Limited
L5 = FERRITE
MOD2 = UNO_SHIELD_MECH
MOD3 = helix_4 Rev C Module
R1 = RES1
U3 U4 = TXB0108: TI Bir-dir buffer
TP2 TP3 = Test Point: Supplier 1: Digi-Key; Supplier 2: Digi-Key

## Sheet 5 - PSOC & Power.SchDoc
size A3; PageSetup: Record=PageOptions|CenterHorizontal=True|CenterVertical=True|PrintScale=1.00|XCorrection=1.00|YCorrection=1.00|PrintKind=1|BorderSize=5000000|LeftOffset=0|BottomOffset=0|Orientation=2|PaperLength=2970|PaperWidth=2100|Scale=100|PaperSource=7|PrintQuality=-4|MediaType=1|DitherType=10|PaperKind=A4 (210 x 297 mm)|PrintScaleMode=0
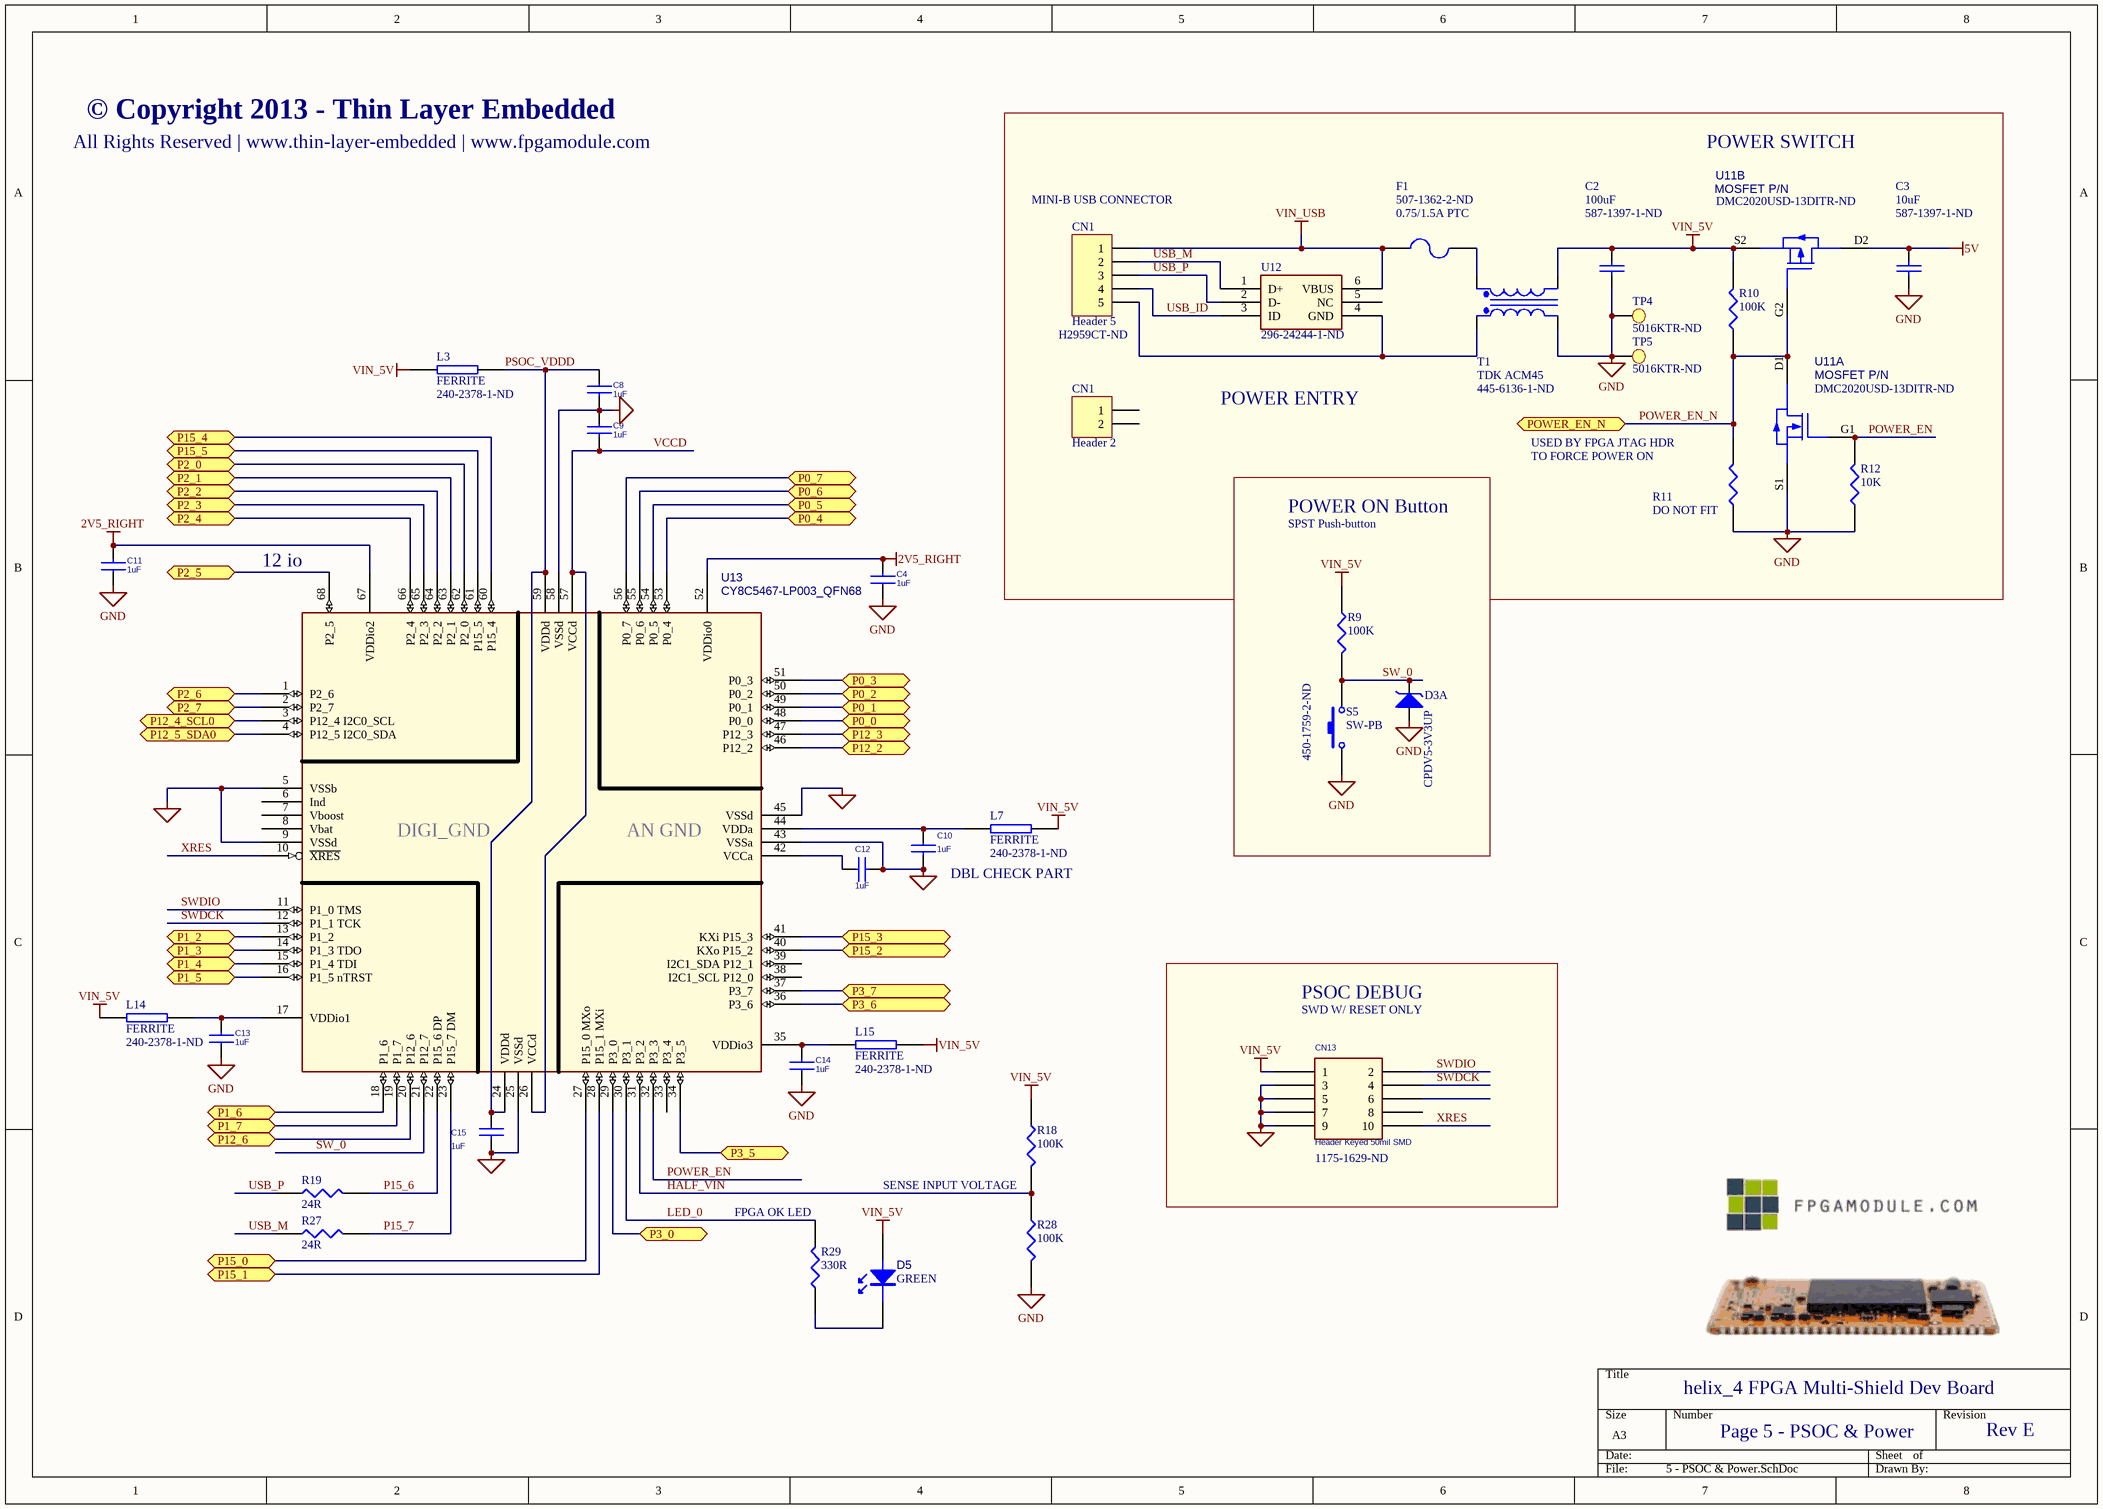
[diagram p4: 5 - PSOC & Power.SchDoc]

### Parts
(Parts that share a designator on the sheet are numbered #1, #2 ... from top to bottom, then left to right.)
C2  100uF  Supplier Part Number 1: 587-1397-1-ND  [1210]
C3  10uF  Supplier Part Number 1: 587-1397-1-ND  [0805]
C4  1uF  [0402_HD]
C8  1uF  [0402_HD]
C9  1uF  [0402_HD]
C10  1uF  [0402_HD]
C11  1uF  [0402_HD]
C12  1uF  [0402_HD]
C13  1uF  [0402_HD]
C14  1uF  [0402_HD]
C15  1uF  [0402_HD]
CN1#1  Header 5  Supplier Part Number 1: H2959CT-ND  [USB_MINI_B]
CN1#2  Header 2  [Connector-Molex-43650-0200]
CN13  Header Keyed 50mil SMD  Supplier Part Number 1: 1175-1629-ND  [SBH41_127_10W_DUAL]
D3  CPDV5-3V3UP  [sot-353]  (part A of 4)
D5  GREEN  [0805_HD_LED]
F1  0.75/1.5A PTC  Supplier Part Number 1: 507-1362-2-ND  [1812]
L3  FERRITE  Supplier Part Number 1: 240-2378-1-ND  [0402_HD]
L7  FERRITE  Supplier Part Number 1: 240-2378-1-ND  [0402_HD]
L14  FERRITE  Supplier Part Number 1: 240-2378-1-ND  [0402_HD]
L15  FERRITE  Supplier Part Number 1: 240-2378-1-ND  [0402_HD]
R9  100K  [0805]
R10  100K  [0805]
R11  DO NOT FIT  [0805]
R12  10K  [0805]
R18  100K  [0805]
R19  24R  [0402_HD]
R27  24R  [0402_HD]
R28  100K  [0805]
R29  330R  [0805]
S5  SW-PB  Supplier Part Number 1: 450-1759-2-ND  [FSM4JSMA]
T1  TDK ACM45  Supplier Part Number 1: 445-6136-1-ND  [TDK_ACM45]
TP4  Supplier Part Number 2: 5016KTR-ND  [TEST_POINT]  (hidden comment: Test Point)
TP5  Supplier Part Number 2: 5016KTR-ND  [TEST_POINT]  (hidden comment: Test Point)
U11  MOSFET P/N  Supplier Part Number 1: DMC2020USD-13DITR-ND  [WSMini6-F1-B]  (parts A,B of 2)
U12  Supplier Part Number 1: 296-24244-1-ND  [DRY6]  (hidden comment: SN65220 USB TVS SOT23-6_0)
U13  CY8C5467-LP003_QFN68  [PSOC_QFN68_HD]

### Blocks framed on the sheet
POWER ON Button: D3 R9 S5
PSOC DEBUG: CN13

### Ports
P0_0, P0_1, P0_2, P0_3, P0_4, P0_5, P0_6, P0_7, P1_2, P1_3, P1_4, P1_5, P1_6, P1_7, P2_0, P2_1, P2_2, P2_3, P2_4, P2_5, P2_6, P2_7, P3_0, P3_5, P3_6, P3_7, P12_2, P12_3, P12_4_SCL0, P12_5_SDA0, P12_6, P15_0, P15_1, P15_2, P15_3, P15_4, P15_5, POWER_EN_N

### Nets
2V5_RIGHT: C4.2 C11.2 U13.52(VDDio0) U13.67(VDDio2)
5V: C3.1 U11.D2
GND: C2.2 C3.2 C4.1 C8.2 C9.1 C10.2 C11.1 C12.2 C13.1 C14.1 C15.2 CN1#2.0 CN13.3 CN13.5 CN13.7 CN13.9 D3.2(A) R11.1 R12.1 R28.2 S5.1 T1.4(Sec-) TP4.1 TP5.1 U11.S1 U13.5(VSSb) U13.9(VSSd) U13.25(VSSd) U13.43(VSSa) U13.45(VSSd) U13.58(VSSd)
VIN_5V: C2.1 CN13.1 D5.A L3.1 L7.2 L14.2 L15.2 R9.1 R10.2 R18.1 T1.2(Pri-) U11.S2
VIN_USB: CN1#1.1 F1.2 U12.6(VBUS)
ASDO: U13.50(P0_2) ; port P0_2
B2_19: U13.56(P0_7) ; port P0_7
B2_20: U13.55(P0_6) ; port P0_6
B2_21: U13.54(P0_5) ; port P0_5
B2_22: U13.53(P0_4) ; port P0_4
B5_CLKIN_N: U13.48(P0_0) ; port P0_0
B5_CLKIN_P: U13.49(P0_1) ; port P0_1
CONF_DONE: U13.47(P12_3) ; port P12_3
DATA0: U13.65(P2_3) ; port P2_3
DCLK: U13.51(P0_3) ; port P0_3
HALF_VIN: R18.2 R28.1 U13.31(P3_2)
LED_0: R29.2 U13.30(P3_1)
MOD0_A0: U13.18(P1_6) ; port P1_6
MOD0_A1: U13.19(P1_7) ; port P1_7
MOD0_A2: U13.27(P15_0_MXo) ; port P15_0
MOD0_A3: U13.28(P15_1_MXi) ; port P15_1
MOD1_A0: U13.13(P1_2) ; port P1_2
MOD1_A1: U13.14(P1_3_TDO) ; port P1_3
MOD1_A2: U13.15(P1_4_TDI) ; port P1_4
MOD1_A3: U13.16(P1_5_nTRST) ; port P1_5
MOD2_A0: U13.40(KXo_P15_2) ; port P15_2
MOD2_A1: U13.41(KXi_P15_3) ; port P15_3
MOD2_A2: U13.37(P3_7) ; port P3_7
MOD2_A3: U13.36(P3_6) ; port P3_6
nCE: U13.3(P12_4_I2C0_SCL) ; port P12_4_SCL0
nCONFIG: U13.64(P2_2) ; port P2_2
nCSO: U13.46(P12_2) ; port P12_2
nSTATUS: U13.63(P2_1) ; port P2_1
P15_6: R19.1 U13.22(P15_6_DP)
P15_7: R27.1 U13.23(P15_7_DM)
POWER_EN: R12.2 U11.G1 U13.32(P3_3)
POWER_EN_N: R10.1 R11.2 U11.D1 U11.G2 ; port POWER_EN_N
PSOC_VDDD: C8.1 C15.1 L3.2 U13.24(VDDd) U13.59(VDDd)
SW_0: D3.3(K1) R9.2 S5.2 U13.21(P12_7)
SWDCK: CN13.4 U13.12(P1_1_TCK)
SWDIO: CN13.2 U13.11(P1_0_TMS)
TCK: U13.66(P2_4) ; port P2_4
TDI_FPGA: U13.68(P2_5) ; port P2_5
TDO_FPGA: U13.2(P2_7) ; port P2_7
TMS: U13.1(P2_6) ; port P2_6
USB_ID: CN1#1.4 U12.3(ID)
USB_M: CN1#1.2 R27.2 U12.1(D+)
USB_P: CN1#1.3 R19.2 U12.2(D-)
VCCD: C9.2 U13.26(VCCd) U13.57(VCCd)
XRES: CN13.10 U13.10(~{XRES})
NetC10_1: C10.1 L7.1 U13.44(VDDa)
NetC12_1: C12.1 U13.42(VCCa)
NetC13_2: C13.2 L14.1 U13.17(VDDio1)
NetC14_2: C14.2 L15.1 U13.35(VDDio3)
NetCN1#1_5: CN1#1.5 T1.3(Sec+) U12.4(GND)
NetD5_K: D5.K R29.1
NetF1_1: F1.1 T1.1(Pri+)
NetU13_4: U13.4(P12_5_I2C0_SDA) ; port P12_5_SDA0
NetU13_20: U13.20(P12_6) ; port P12_6
NetU13_29: U13.29(P3_0) ; port P3_0
NetU13_34: U13.34(P3_5) ; port P3_5
NetU13_60: U13.60(P15_4) ; port P15_4
NetU13_61: U13.61(P15_5) ; port P15_5
NetU13_62: U13.62(P2_0) ; port P2_0

Not connected (* = marked no-connect by the designer): CN1#2 1 2; CN13 6 8; U12 5(NC); U13 6(Ind) 7(Vboost) 8(Vbat) 33(P3_4) 38(I2C1_SCL_P12_0) 39(I2C1_SDA_P12_1)

### Notes on the sheet
- All Rights Reserved | www.thin-layer-embedded | www.fpgamodule.com
- © Copyright 2013 - Thin Layer Embedded
- POWER SWITCH
- (near CN1#1) MINI-B USB CONNECTOR
- POWER ENTRY
- USED BY FPGA JTAG HDR
- TO FORCE POWER ON
- (near U13) 12 io
- SPST Push-button
- (near U13) DIGI_GND
- (near U13) AN GND
- DBL CHECK PART
- SWD W/ RESET ONLY
- SENSE INPUT VOLTAGE
- (near R29) FPGA OK LED
- helix_4 FPGA Multi-Shield Dev Board
- Page 5 - PSOC & Power
- Rev E

### Library data of the parts
C2 C3 = CAP: Capacitor; Supplier 1: Digi-Key
C4 C9 C11-C14 = CAP: CAP CER 1.2 uF 10 V 10% X5R 0805 SMD; Part Number: 700-00097; Last Edit By: SNF; CLASS: DISCRETE; FPLIST: CAPC2012X100N,CAPC2012X100L,CAPC2012X100M; Rated Voltage: 10 V; Package Size: 0805; Tolerance: 10%
C8 C10 = CAP: CAP, CER, 10 uF, 16 V, 5%, X5R, 0805, SMD; Part Number: 700-00105; ALT_SYMBOLS: CAPC2012X140N,CAPC2012X140L,CAPC2012X140M; Last Edit By: SNF; CLASS: DISCRETE; Rated Voltage: 16 V; Operating Temperature Maximum: 85 C; Operating Temperature Minimum: -25 C; Package Size: 0805; FPLIST: CAPC2012X140N,CAPC2012X140L,CAPC2012X140M; Tolerance: 5%
C15 = CAP: CAP, CER, 1.0 uF, 10 V, 10%, X5R, 0603, SMD; Part Number: 700-00111; ALT_SYMBOLS: CAPC1608X55N,CAPC1608X55L,CAPC1608X55M; Last Edit By: SNF; CLASS: DISCRETE; Rated Voltage: 10 V; Tolerance: 10%; FPLIST: CAPC1608X55N,CAPC1608X55L,CAPC1608X55M; Package Size: 0603; Operating Temperature Minimum: -55 C; Operating Temperature Maximum: 85 C
CN1#1 = Header 5: Header, 5-Pin; LatestRevisionDate: 17-Jul-2002; LatestRevisionNote: Re-released for DXP Platform.; Publisher: Altium Limited; Supplier 1: Digi-Key
CN1#2 = Header 2: Header, 2-Pin; LatestRevisionDate: 17-Jul-2002; LatestRevisionNote: Re-released for DXP Platform.; Publisher: Altium Limited
CN13 = HDR_2X5: CONN, HDR, KEYED, 2x5, 0.050", Gold, SMD; Part Number: 400-00018; Last Edit By: SNF; CLASS: IO; ALT_SYMBOLS: ftsh-105-xx-x-dv-k; Package Type: SMD; Operating Temperature Minimum: -55 C; Operating Temperature Maximum: 125 C; Supplier 1: Digi-Key
D3 = 4CH ESD DIODE (SPLIT): 4CH ESD DIODE 3V3/3.5V
D5 = LED: Supplier 1: Digi-Key
F1 = Fuse 2: Fuse; Published: 8-Jun-2000; LatestRevisionDate: 17-Jul-2002; LatestRevisionNote: Re-released for DXP Platform.; PackageReference: PIN-W2/E2.8; Publisher: Altium Limited; Supplier 1: Digi-Key
L3 L7 L14 L15 = FERRITE: Manufacturer: Laird-Signal Integrity Products; Manufacturer Part Number: HI0805R800R-10; Description: FERRITE CHIP POWER 80 OHM SMD; Impedance @ Frequency: 80 Ohm @ 100MHz; Current Rating: 5A; DC Resistance (DCR): 10.00 mOhm Max; Filter Type: Differential Mode - Single; Number of Lines: 1; Supplier 1: Digi-Key; RoHS: RoHS Compliant; Category: Filters; Stock 1: 36575; Pricing 1: 10=0.089, 50=0.0768, 100=0.0708, 250=0.059, 500=0.0531, 1000=0.0472 (USD); Package / Case: 0805 (2012 metric); Mounting Type: Surface Mount; Packaging: Cut Tape (CT); ComponentLink1URL: http://www.steward.com/view_print.asp?St_PartNo=HI0805R800R-10; ComponentLink1Description: http://www.steward.com/view_print.asp?St_PartNo=HI0805R800R-10
R9-R12 R18 R28 R29 = RES1
R19 R27 = RES1: Manufacturer: Yageo; Manufacturer Part Number: RC0402FR-0724R9L; Description: RES 24.9 OHM 1/16W 1% 0402 SMD; Resistance (Ohms): 24.9; Power (Watts): 0.063W, 1/16W; Temperature Coefficient: ±100ppm/°C; Tolerance: ±1%; Supplier 1: Digi-Key; RoHS: RoHS Compliant; Category: Resistors; Stock 1: 237555; Pricing 1: 10=0.014, 50=0.0104, 100=0.0079, 250=0.00584, 500=0.00432, 1000=0.00288 (USD); Composition: Thick Film; Features: -; Size / Dimension: 0.039" L x 0.020" W (1.00mm x 0.50mm); Height: 0.014" (0.35mm); Number of Terminations: 2; Packaging: Cut Tape (CT); Package / Case: 0402 (1005 Metric); ComponentLink1URL: http://www.yageo.com/documents/recent/PYu-RC0402_51_RoHS_L_6.pdf; ComponentLink1Description: http://www.yageo.com/documents/recent/PYu-RC0402_51_RoHS_L_6.pdf; Supplier 2: Digi-Key; Stock 2: 302870; Pricing 2: 10=0.014, 50=0.0104, 100=0.0079, 250=0.00584, 500=0.00432, 1000=0.00288 (USD); ComponentLink2URL: http://www.yageo.com/documents/recent/PYu-RC0603_51_RoHS_L_4.pdf; ComponentLink2Description: http://www.yageo.com/documents/recent/PYu-RC0603_51_RoHS_L_4.pdf
S5 = SW-PB: Switch; Published: 24-Mar-1999; LatestRevisionDate: 17-Jul-2002; LatestRevisionNote: Re-released for DXP Platform.; PackageReference: SPST-2; Publisher: Altium Limited; Supplier 1: Digi-Key
T1 = Trans Ideal: Transformer (Ideal); Published: 8-Jun-2000; LatestRevisionDate: 17-Jul-2002; LatestRevisionNote: Re-released for DXP Platform.; PackageReference: TRF_4; Publisher: Altium Limited; Supplier 1: Digi-Key
U11 = PN_PAIR: Supplier 1: Digi-Key
U13 = CY8C38XX_100P_ALT: IC, PSoC3; Part Number: 500-00031; Last Edit By: SNF; ALT_SYMBOLS: tqfpa100; Description: IC, PSoC3, 64K, CY8C3866AXI-040, TQFP-100, SMD; CLASS: IC; Operating Temperature Minimum: -40 C; Operating Temperature Maximum: 85 C; Package Size: TQFP-100
TP4 TP5 = Test Point: Supplier 1: Digi-Key; Supplier 2: Digi-Key
U12 = SN65220 USB TVS SOT23-6_0: Supplier 1: Digi-Key

## Nets that join several sheets
2V5_BOT: 3 - IO Socket 1 (8 pins), 2 - IO Socket 0 (9 pins)
2V5_LEFT: 3 - IO Socket 1 (5 pins), 4 - IO Socket 2 (7 pins)
2V5_RIGHT: 1 - Top (CN2.4), 2 - IO Socket 0 (MOD3.13 MOD3.14), 5 - PSOC & Power (C4.2 C11.2 U13.52 U13.67)
2V5_TOP: 1 - Top (R7.1 R8.1), 4 - IO Socket 2 (MOD3.43)
3V3_LEFT: 3 - IO Socket 1 (L2.1 L6.1 MOD3.73), 4 - IO Socket 2 (L4.1 L5.1)
5V: 1 - Top (MOD3.26), 3 - IO Socket 1 (L9.1 L11.1), 2 - IO Socket 0 (L1.1 L8.1), 4 - IO Socket 2 (L10.1 L16.1), 5 - PSOC & Power (C3.1 U11.D2)
GND: 1 - Top (29 pins), 3 - IO Socket 1 (32 pins), 2 - IO Socket 0 (29 pins), 4 - IO Socket 2 (26 pins), 5 - PSOC & Power (31 pins)
ASDO: 1 - Top (D3.4 R8.2 S3.2), 4 - IO Socket 2 (MOD3.49), 5 - PSOC & Power (U13.50)
B1_10: 3 - IO Socket 1 (U5.9), 4 - IO Socket 2 (MOD3.64)
B1_11: 3 - IO Socket 1 (U5.8), 4 - IO Socket 2 (MOD3.65)
B2_19: 3 - IO Socket 1 (MOD3.86), 5 - PSOC & Power (U13.56)
B2_20: 3 - IO Socket 1 (MOD3.87), 5 - PSOC & Power (U13.55)
B2_21: 3 - IO Socket 1 (MOD3.89), 5 - PSOC & Power (U13.54)
B2_22: 3 - IO Socket 1 (MOD3.90), 5 - PSOC & Power (U13.53)
B5_25: 3 - IO Socket 1 (U7.6), 2 - IO Socket 0 (MOD3.97)
B5_26: 3 - IO Socket 1 (U7.5), 2 - IO Socket 0 (MOD3.98)
B5_CLKIN_N: 2 - IO Socket 0 (MOD3.11), 5 - PSOC & Power (U13.48)
B5_CLKIN_P: 2 - IO Socket 0 (MOD3.10), 5 - PSOC & Power (U13.49)
B6_39_nCEO: 2 - IO Socket 0 (U9.1), 4 - IO Socket 2 (MOD3.18)
CONF_DONE: 1 - Top (MOD3.17), 5 - PSOC & Power (U13.47)
DATA0: 4 - IO Socket 2 (MOD3.62), 5 - PSOC & Power (U13.65)
DCLK: 1 - Top (D3.1 R7.2 S2.2), 4 - IO Socket 2 (MOD3.59), 5 - PSOC & Power (U13.51)
MOD0_A0: 2 - IO Socket 0 (CN8.9), 5 - PSOC & Power (U13.18)
MOD0_A1: 2 - IO Socket 0 (CN8.10), 5 - PSOC & Power (U13.19)
MOD0_A2: 2 - IO Socket 0 (CN8.11), 5 - PSOC & Power (U13.27)
MOD0_A3: 2 - IO Socket 0 (CN8.12), 5 - PSOC & Power (U13.28)
MOD1_A0: 3 - IO Socket 1 (CN16.9), 5 - PSOC & Power (U13.13)
MOD1_A1: 3 - IO Socket 1 (CN16.10), 5 - PSOC & Power (U13.14)
MOD1_A2: 3 - IO Socket 1 (CN16.11), 5 - PSOC & Power (U13.15)
MOD1_A3: 3 - IO Socket 1 (CN16.12), 5 - PSOC & Power (U13.16)
MOD2_A0: 4 - IO Socket 2 (CN21.9), 5 - PSOC & Power (U13.40)
MOD2_A1: 4 - IO Socket 2 (CN21.10), 5 - PSOC & Power (U13.41)
MOD2_A2: 4 - IO Socket 2 (CN21.11), 5 - PSOC & Power (U13.37)
MOD2_A3: 4 - IO Socket 2 (CN21.12), 5 - PSOC & Power (U13.36)
nCE: 1 - Top (MOD3.70), 5 - PSOC & Power (U13.3)
nCONFIG: 1 - Top (D3.5 MOD3.61 S1.2), 5 - PSOC & Power (U13.64)
nCSO: 1 - Top (MOD3.51), 5 - PSOC & Power (U13.46)
nSTATUS: 1 - Top (MOD3.60), 5 - PSOC & Power (U13.63)
POWER_EN_N: 1 - Top (CN2.2), 5 - PSOC & Power (R10.1 R11.2 U11.D1 U11.G2)
SCL: 3 - IO Socket 1 (U6.1), 2 - IO Socket 0 (U10.1), 4 - IO Socket 2 (MOD3.46 U3.9)
SDA: 3 - IO Socket 1 (U7.9), 2 - IO Socket 0 (U10.3), 4 - IO Socket 2 (MOD3.45 U3.8)
TCK: 1 - Top (CN2.1 D4.5 MOD3.66), 5 - PSOC & Power (U13.66)
TDI_FPGA: 1 - Top (CN2.9 D4.1 MOD3.67), 5 - PSOC & Power (U13.68)
TDO_FPGA: 1 - Top (CN2.3 D4.4 MOD3.69), 5 - PSOC & Power (U13.2)
TMS: 1 - Top (CN2.5 D4.3 MOD3.68), 5 - PSOC & Power (U13.1)